# Altium schematic sheet Sheet1.SchDoc
size A4; SheetNumber: 1; SheetTotal: 7
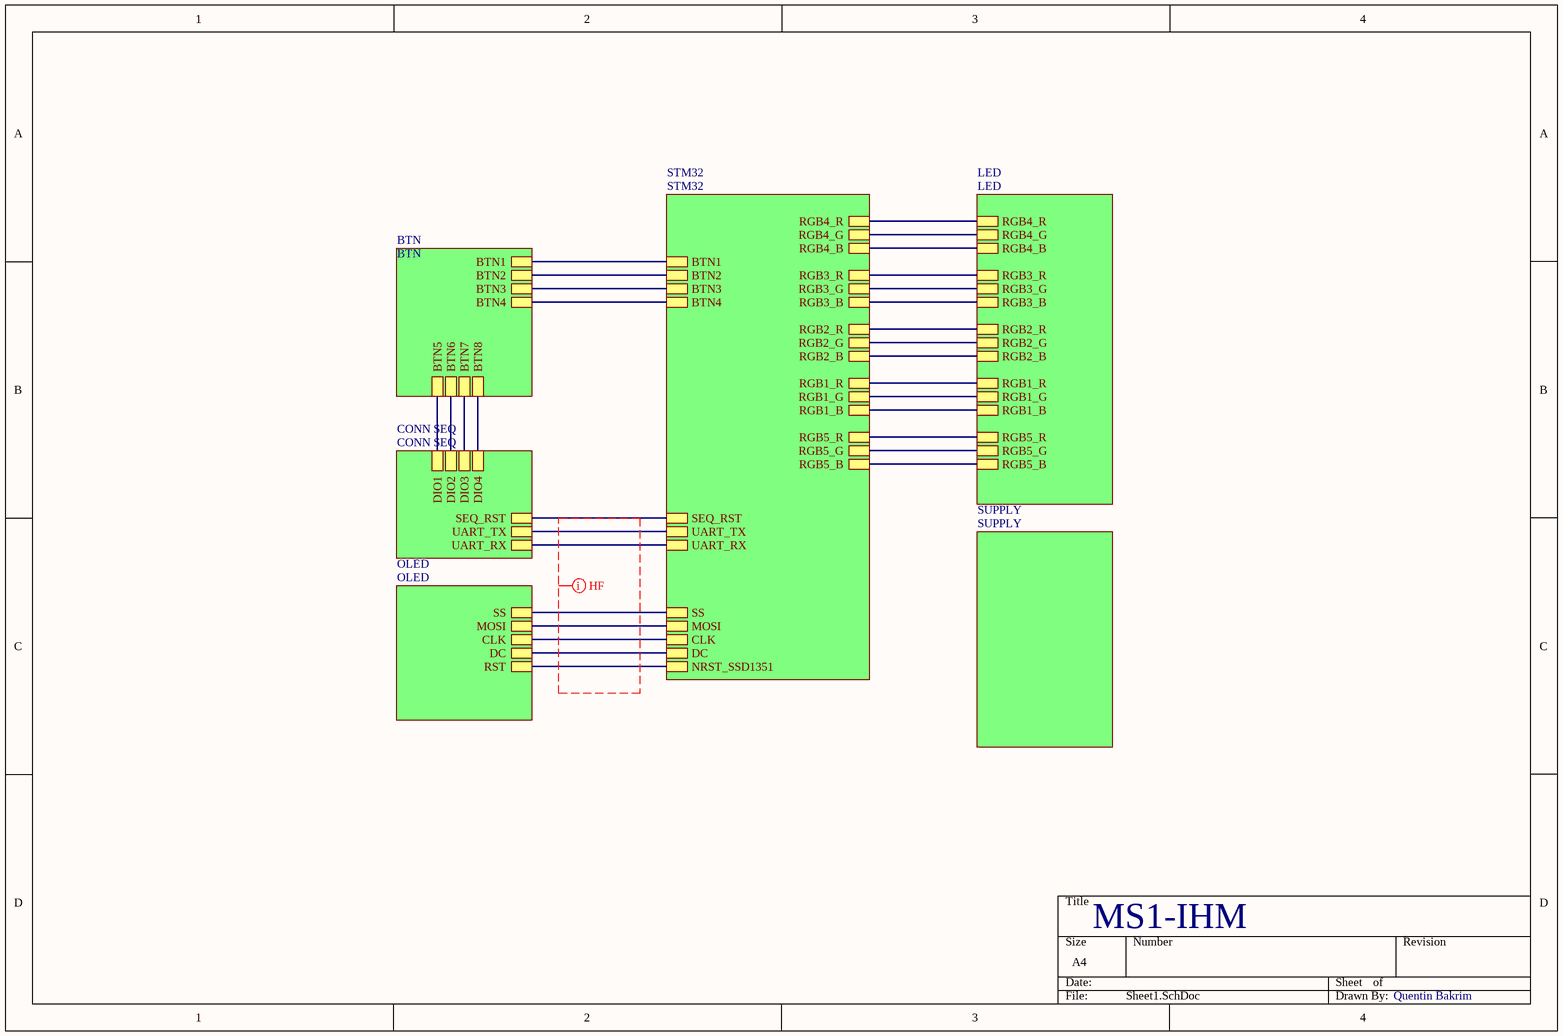
[diagram p0: Sheet1.SchDoc]

## Sub-sheets
BTN = BTN: BTN6, BTN1, BTN5, BTN4, BTN3, BTN2, BTN7, BTN8
CONN SEQ = CONN SEQ: UART_RX, DIO4, UART_TX, DIO3, DIO2, DIO1, SEQ_RST
LED = LED: RGB4_R, RGB4_B, RGB3_G, RGB5_B, RGB5_R, RGB5_G, RGB4_G, RGB1_B, RGB3_R, RGB1_R, RGB2_G, RGB2_R, RGB1_G, RGB3_B, RGB2_B
OLED = OLED: RST, SS, CLK, DC, MOSI
STM32 = STM32: RGB4_R, RGB4_B, RGB3_G, BTN1, BTN2, RGB5_B, RGB5_R, BTN3, RGB5_G, RGB4_G, BTN4, UART_RX, RGB1_B, RGB3_R, RGB1_R, RGB2_G, UART_TX, RGB2_R, RGB1_G, RGB3_B, RGB2_B, SS, MOSI, CLK, DC, NRST_SSD1351, SEQ_RST
SUPPLY = SUPPLY: no entries

## Nets
(unnamed): sheet BTN/BTN6, sheet CONN SEQ/DIO2
(unnamed): sheet BTN/BTN1, sheet STM32/BTN1
(unnamed): sheet BTN/BTN5, sheet CONN SEQ/DIO1
(unnamed): sheet BTN/BTN4, sheet STM32/BTN4
(unnamed): sheet BTN/BTN3, sheet STM32/BTN3
(unnamed): sheet BTN/BTN2, sheet STM32/BTN2
(unnamed): sheet BTN/BTN7, sheet CONN SEQ/DIO3
(unnamed): sheet BTN/BTN8, sheet CONN SEQ/DIO4
(unnamed): sheet STM32/RGB4_R, sheet LED/RGB4_R
(unnamed): sheet STM32/RGB4_B, sheet LED/RGB4_B
(unnamed): sheet STM32/RGB3_G, sheet LED/RGB3_G
(unnamed): sheet STM32/RGB5_B, sheet LED/RGB5_B
(unnamed): sheet STM32/RGB5_R, sheet LED/RGB5_R
(unnamed): sheet STM32/RGB5_G, sheet LED/RGB5_G
(unnamed): sheet STM32/RGB4_G, sheet LED/RGB4_G
(unnamed): sheet STM32/UART_RX, sheet CONN SEQ/UART_RX
(unnamed): sheet STM32/RGB1_B, sheet LED/RGB1_B
(unnamed): sheet STM32/RGB3_R, sheet LED/RGB3_R
(unnamed): sheet STM32/RGB1_R, sheet LED/RGB1_R
(unnamed): sheet STM32/RGB2_G, sheet LED/RGB2_G
(unnamed): sheet STM32/UART_TX, sheet CONN SEQ/UART_TX
(unnamed): sheet STM32/RGB2_R, sheet LED/RGB2_R
(unnamed): sheet STM32/RGB1_G, sheet LED/RGB1_G
(unnamed): sheet STM32/RGB3_B, sheet LED/RGB3_B
(unnamed): sheet STM32/RGB2_B, sheet LED/RGB2_B
(unnamed): sheet STM32/SS, sheet OLED/SS
(unnamed): sheet STM32/MOSI, sheet OLED/MOSI
(unnamed): sheet STM32/CLK, sheet OLED/CLK
(unnamed): sheet STM32/DC, sheet OLED/DC
(unnamed): sheet STM32/NRST_SSD1351, sheet OLED/RST
(unnamed): sheet STM32/SEQ_RST, sheet CONN SEQ/SEQ_RST

## Layout directives
net class HF: (no net found under the mark)

## Notes on the sheet
- MS1-IHM
- Quentin Bakrim